# Altium schematic sheet Main_cicuit.SchDoc
size 350 x 469 mm; SheetNumber: 1; SheetTotal: 1; SPICEModelCacheATQZOLGF: <root> / <DocumentId>ATQZOLGF</DocumentId> / <CacheFrame Number="0"> / <Model Name="emk316bbj476_l-t" Kind="CKT"> / <Text>* EMK316BBJ476_L-T     SPICE MODEL  ( General Type ) / *-------------------------------------------------------------------------------------------------------- / * Model Generated by TAIYO YUDEN Corporation (http://www.ty-top.com) / * Version 1.0 / * TAIYO YUDEN Control No. 170508_160201 / * Copyright(c) 2016 TAIYO YUDEN CO.,LTD. All Rights Reserved. / *-------------------------------------------------------------------------------------------------------- / * / * Products Name : Multilayer Ceramic Capacitors / * / * Characteristics : / *     Capacitance : 47 uF , Rated Voltage : 16V , TCC : X5R / *     Case Size : 3.2 x 1.6 / 0.126 x 0.063 [mm/inch] , Thickness : 1.6 / 0.063 [mm/inch] / *     (Conditions: Temperature = 25 degC , DC Bias Current/Voltage = 0A / 0V) / * / * Frequency Range : 40Hz - 3GHz / * / * External Node Assignments : / * / *  1  o---| |---o  2 / * / *-------------------------------------------------------------------------------------------------------- / .SubCkt EMK316BBJ476_L-T 1 2 / **************************** / C0 1 110 39.785u / Cm 1 101 2.9335u / C1 101 102 3.2986u / Rc1 101 102 158.48 / C2 102 103 2.1731u / Rc2 102 103 15.988 / C3 103 110 0.1168u / Rc3 103 110 3.1602 / C2m 1 301 5.1294u / C21 301 302 6.2048u / Rc21 301 302 908.8 / C22 302 303 7.0189u / Rc22 302 303 251.89 / C23 303 304 10.585u / Rc23 303 304 121.1 / C24 304 305 1.745u / Rc24 304 305 66.669 / C25 305 306 2.0483u / Rc25 305 306 43.084 / C26 306 307 0.83506u / Rc26 306 307 3.353 / C27 307 308 0.20912u / Rc27 307 308 8.5674 / C28 308 309 0.87358u / Rc28 308 309 1.8455 / C29 309 110 0.051814u / Rc29 309 110 3.3713 / Rp0 1 110 2.12765957446809Meg / L0 110 120 0.23607n / Lm 120 130 0.28508n / L1 120 121 0.18542n / RL1 121 130 7.9423 / L2 120 122 0.18844n / RL2 122 130 0.11704 / L3 120 123 2.5471n / RL3 123 130 0.25894 / CR 120 124 7.083u / LR 124 125 0.6729n / RR 125 130 10.406m / CL 130 140 0.7161p / LL 130 140 0.23733n / RL 130 140 37.362 / Rs 140 2 2.1493m / **************************** / .ends EMK316BBJ476_L-T</Text> / </Model> / </CacheFrame> / </root>
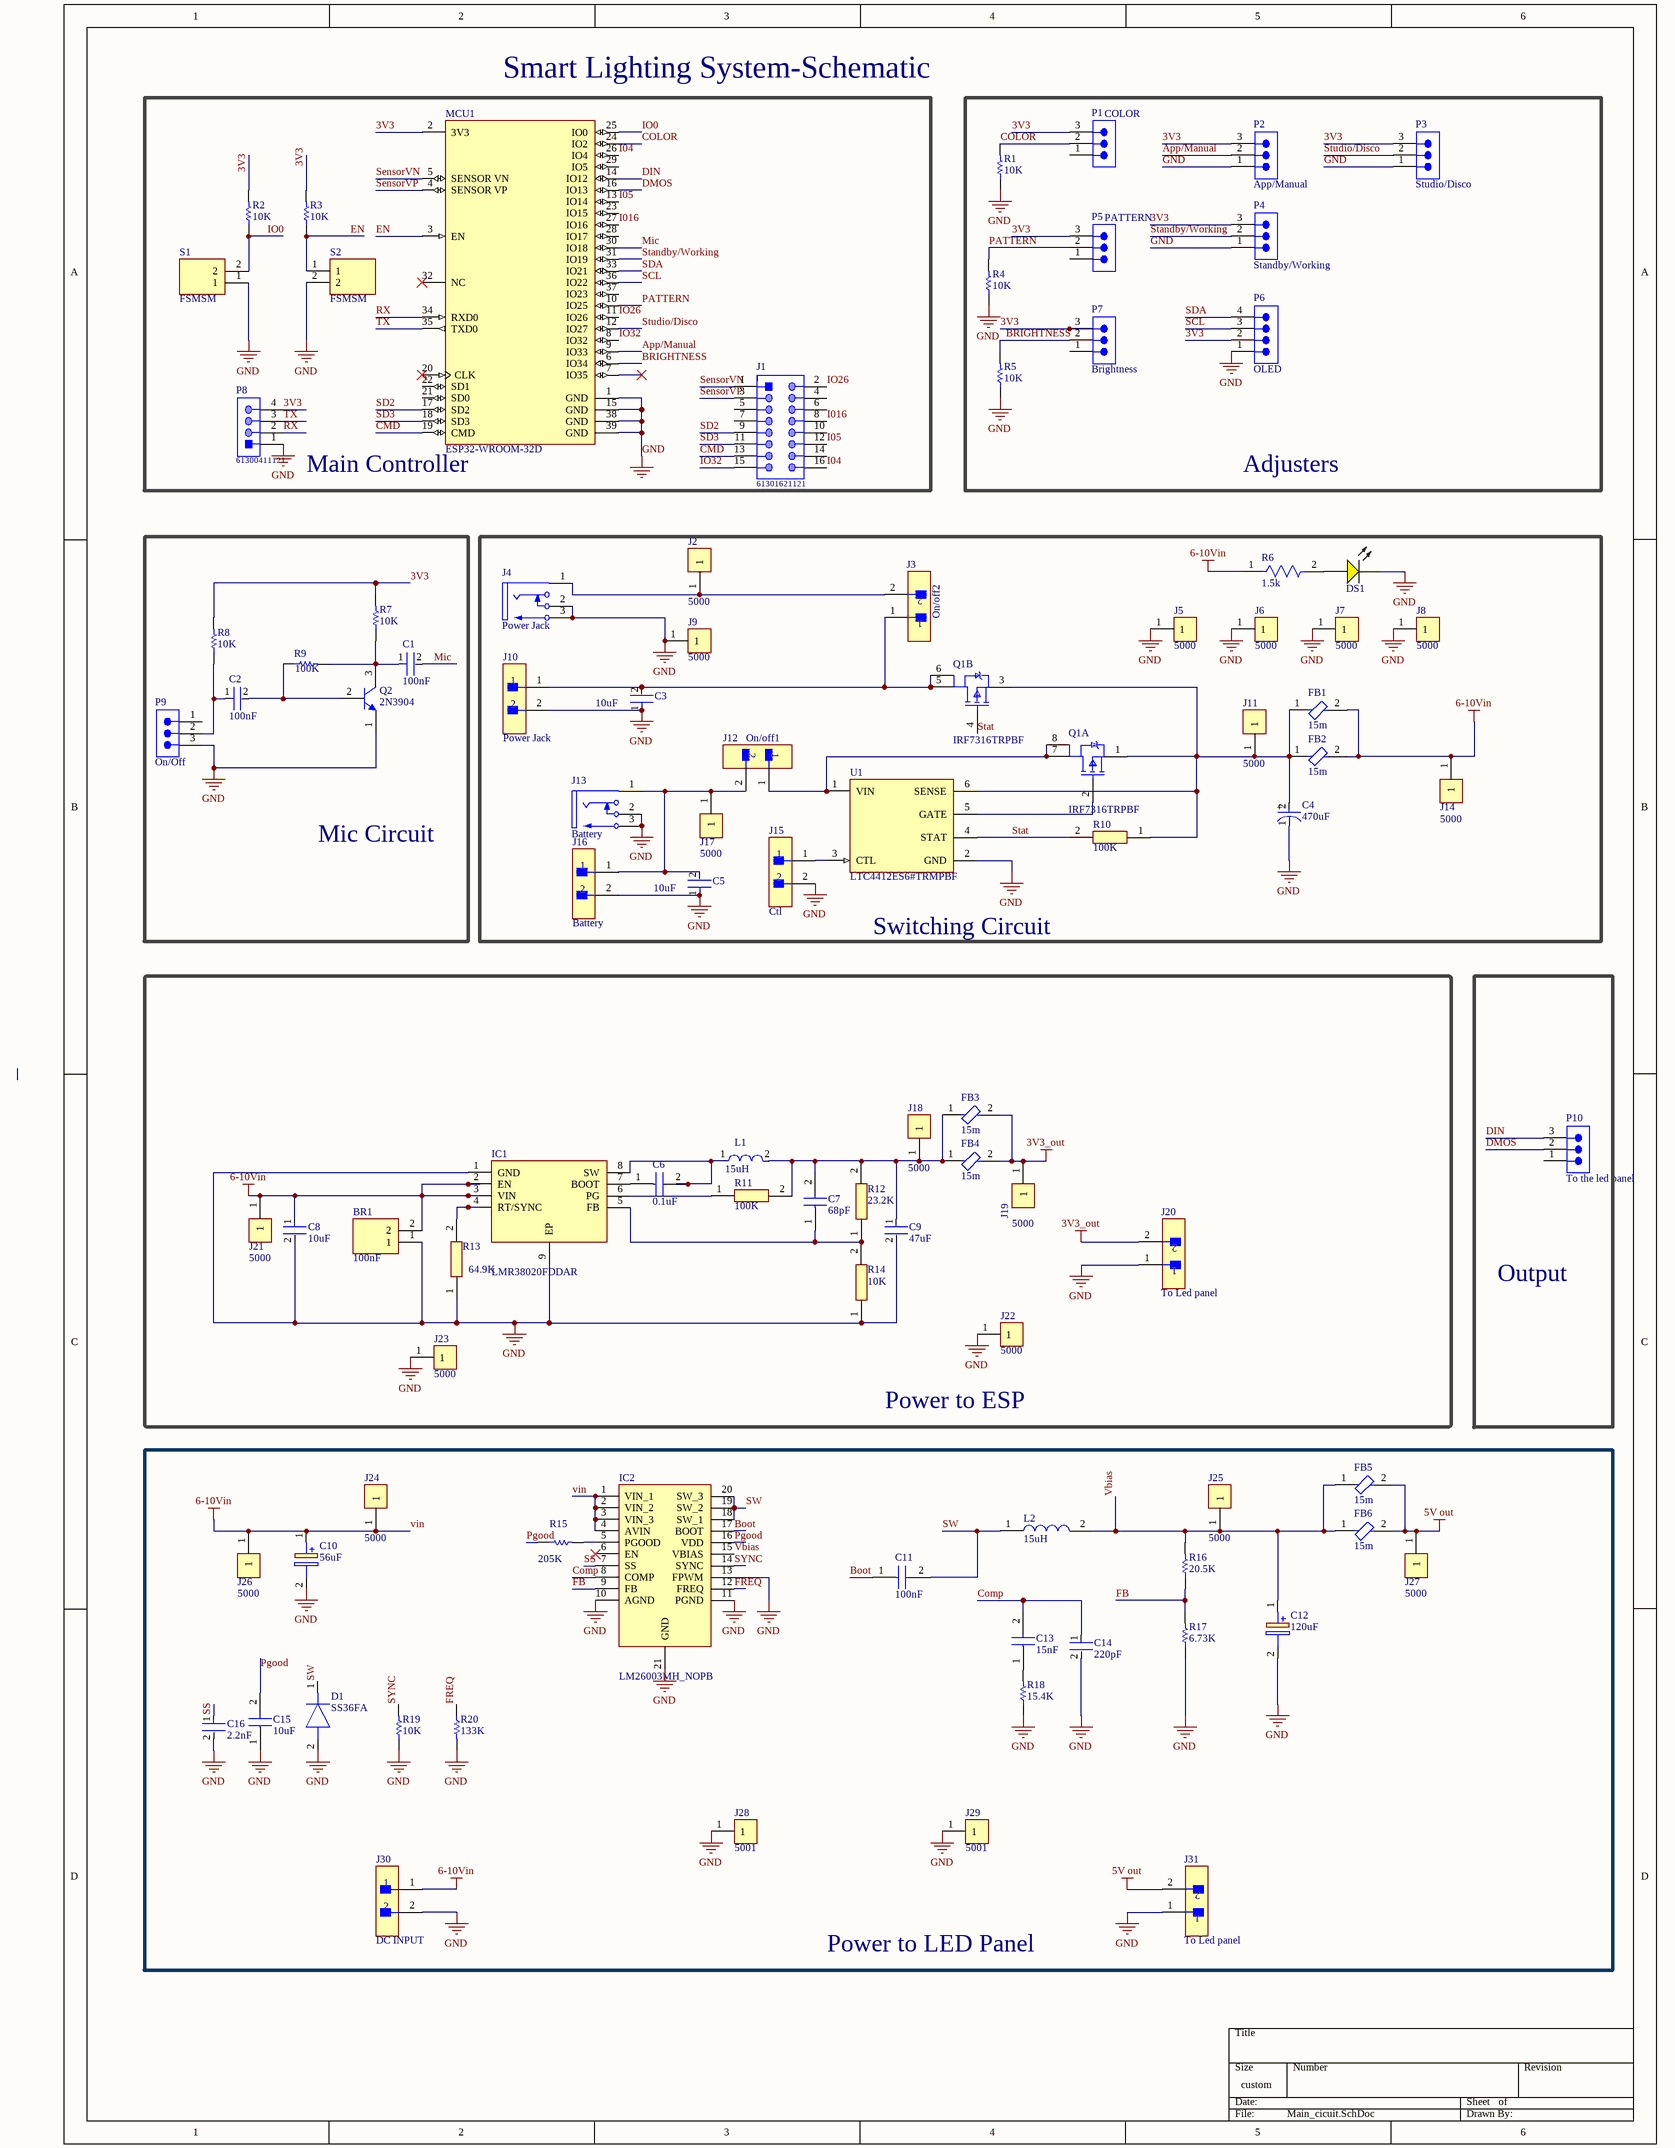
[diagram p0: Main_cicuit.SchDoc]

## Parts
BR1  100nF  [CAPC3216X140N]
C1  100nF  [FP-CL31-IPC_C]
C2  100nF  [FP-CL31-IPC_C]
C3  10uF  [FP-CL21B106KOQNNNG-MFG]
C4  470uF  [FP-FTF-MFG]
C5  10uF  [FP-CL21B106KOQNNNG-MFG]
C6  0.1uF  [CAPC3216X200N]
C7  68pF  [CAPC3216X90N]
C8  10uF  [FP-GRM31C-0_2-e0_3_0_8-MFG]
C9  47uF  [FP-1206-L_3_2_0_3-W_1_6_0-MFG]
C10  56uF  [EEHZA1E101XP]
C11  100nF  [CAPC2013X94N]
C12  120uF  [10SVPC120M]
C13  15nF  [C2012_Commercial]
C14  220pF  [FP-CL21-IPC_B]
C15  10uF  [CAPC3216X170N]
C16  2.2nF  [FP-CL21-IPC_C]
D1  SS36FA  [SODFL3618X143N]
DS1  SML-LX1206YC-TR  [LUMX-SML-LX1206YC-TR_V]  (value not drawn)
FB1  15m  [FP-BLM21-0_2-t0_85-e0_5-d-IPC_B]
FB2  15m  [FP-BLM21-0_2-t0_85-e0_5-d-IPC_B]
FB3  15m  [FP-BLM21-0_2-t0_85-e0_5-d-IPC_B]
FB4  15m  [FP-BLM21-0_2-t0_85-e0_5-d-IPC_B]
FB5  15m  [FP-BLM21-0_2-t0_85-e0_5-d-IPC_B]
FB6  15m  [FP-BLM21-0_2-t0_85-e0_5-d-IPC_B]
IC1  LMR38020FDDAR  [SOIC127P600X170-9N]
IC2  LM26003MH_NOPB  [SOP65P640X110-21N]
J1  61301621121  [61301621121]
J2  5000  [FP-5000-MFG]
J3  On/off2  [FP-61900211121-MFG]
J4  Power Jack  [SWITCH-RAPC712X-3_V]
J5  5000  [FP-5000-MFG]
J6  5000  [FP-5000-MFG]
J7  5000  [FP-5000-MFG]
J8  5000  [FP-5000-MFG]
J9  5000  [FP-5000-MFG]
J10  Power Jack  [FP-61900211121-MFG]
J11  5000  [FP-5000-MFG]
J12  On/off1  [FP-61900211121-MFG]
J13  Battery  [SWITCH-RAPC712X-3_V]
J14  5000  [FP-5000-MFG]
J15  Ctl  [FP-61900211121-MFG]
J16  Battery  [FP-61900211121-MFG]
J17  5000  [FP-5000-MFG]
J18  5000  [FP-5000-MFG]
J19  5000  [FP-5000-MFG]
J20  To Led panel  [FP-61900211121-MFG]
J21  5000  [FP-5000-MFG]
J22  5000  [FP-5000-MFG]
J23  5000  [FP-5000-MFG]
J24  5000  [FP-5000-MFG]
J25  5000  [FP-5000-MFG]
J26  5000  [FP-5000-MFG]
J27  5000  [FP-5000-MFG]
J28  5001  [FP-5001-MFG]
J29  5001  [FP-5001-MFG]
J30  DC INPUT  [FP-61900211121-MFG]
J31  To Led panel  [FP-61900211121-MFG]
L1  15uH  [FP-SRR1260-MFG]
L2  15uH  [INDPM7366X300N]
MCU1  ESP32-WROOM-32D  [FP-ESP32-WROOM-32D-MFG]
P1  COLOR  [SMTC-TSW-103-07-X-S]
P2  App/Manual  [SMTC-TSW-103-07-X-S]
P3  Studio/Disco  [SMTC-TSW-103-07-X-S]
P4  Standby/Working  [SMTC-TSW-103-07-X-S]
P5  PATTERN  [SMTC-TSW-103-07-X-S]
P6  OLED  [SMTC-TSW-104-08-X-S]
P7  Brightness  [SMTC-TSW-103-07-X-S]
P8  61300411121  [61300411121]
P9  On/Off  [SMTC-TSW-103-07-X-S]
P10  To the led panel  [SMTC-TSW-103-07-X-S]
Q1  IRF7316TRPBF  [FP-PG-DSO-8-IPC_B]  (parts A,B of 2)
Q2  2N3904  [ONSC-TO-92-3-29-11]
R1  10K  [RESC3116X65X40ML10T20]
R2  10K  [RESC3116X65X40ML10T20]
R3  10K  [RESC3116X65X40ML10T20]
R4  10K  [RESC3116X65X40ML10T20]
R5  10K  [RESC3116X65X40ML10T20]
R6  1.5k  [FP-CRCW1206-e3-IPC_C]
R7  10K  [RESC3116X65X40ML10T20]
R8  10K  [RESC3116X65X40ML10T20]
R9  100K  [RESC3116X65X40ML10T20]
R10  100K  [RESC3116X65N]
R11  100K  [RESC3116X65N]
R12  23.2K  [ERJ8ENF1000V]
R13  64.9K  [ERJ8ENF1000V]
R14  10K  [ERJ8ENF1000V]
R15  205K  [RESC3216X60X45NL10T20]
R16  20.5K  [RESC2013X70X40NL20T20]
R17  6.73K  [RESC2013X60X35NL10T20]
R18  15.4K  [RESC3216X70X50LL05T20]
R19  10K  [RESC3116X65X40ML10T20]
R20  133K  [RESC3216X70X50LL20T25]
S1  FSMSM  [FSMSM]
S2  FSMSM  [FSMSM]
U1  LTC4412ES6#TRMPBF  [FP-S6-6-05-08-1636-IPC_C]

## Blocks framed on the sheet
Smart Lighting System-Schematic: J1 MCU1 P8 R2 R3 S1 S2
Adjusters: P1-P7 R1 R4 R5
Mic Circuit: C1 C2 P9 Q2 R7-R9
Switching Circuit: C3-C5 DS1 FB1 FB2 J2-J17 Q1 R6 R10 U1
Power to ESP: BR1 C6-C9 FB3 FB4 IC1 J18-J23 L1 R11-R14
Output: P10
Power to LED Panel: C10-C16 D1 FB5 FB6 IC2 J24-J31 L2 R15-R20

## Nets
3V3_out: FB3.2 FB4.2 J19.1 J20.2
5V out: FB5.2 FB6.2 J27.1 J31.2
GND: BR1.1 C3.1 C4.1(C) C5.1 C8.2 C9.2 C10.2(-) C12.2(-) C14.2 C15.1 C16.2 D1.2(A) DS1.2(K) IC1.1(GND) IC1.9(EP) IC2.10(AGND) IC2.11(PGND) IC2.13(FPWM) IC2.21(GND) J4.2 J4.3 J5.1 J6.1 J7.1 J8.1 J9.1 J10.2 J13.2 J13.3 J15.2 J16.2 J20.1 J22.1 J23.1 J28.1 J29.1 J30.2 J31.1 MCU1.1(GND) MCU1.15(GND) MCU1.38(GND) MCU1.39(GND) P2.1 P3.1 P4.1 P6.1 P8.1 P9.3 Q2.1(E) R1.1 R4.1 R5.1 R13.1 R14.1 R17.1 R18.1 R19.1 R20.2 S1.1 S2.2 U1.2(GND)
vin: BR1.2 C8.1 C10.1(+) FB1.2 FB2.2 IC1.2(EN) IC1.3(VIN) IC2.1(VIN_1) IC2.2(VIN_2) IC2.3(VIN_3) IC2.4(AVIN) J14.1 J21.1 J24.1 J26.1 J30.1 R6.1  [also labelled 6-10Vin]
3V3: MCU1.2(3V3) P1.3 P2.3 P3.3 P4.3 P5.3 P6.2 P7.3 P8.4 R2.2 R3.2 R7.2 R8.2
App/Manual: MCU1.9(IO33) P2.2
Boot: C11.1(C1) IC2.17(BOOT)
BRIGHTNESS: MCU1.6(IO34) P7.2 R5.2
CMD: J1.13 MCU1.19(CMD)
COLOR: MCU1.24(IO2) P1.2 R1.2
Comp: C13.2 C14.1 IC2.8(COMP)
DIN: MCU1.14(IO12) P10.3
DMOS: MCU1.16(IO13) P10.2
EN: MCU1.3(EN) R3.1 S2.1
FB: IC2.9(FB) R16.1 R17.2
FREQ: IC2.12(FREQ) R20.1
I04: J1.16 MCU1.26(IO4)
I05: J1.12 MCU1.13(IO14)
I016: J1.8 MCU1.27(IO16)
IO0: MCU1.25(IO0) R2.1 S1.2
IO26: J1.2 MCU1.11(IO26)
IO32: J1.15 MCU1.8(IO32)
Mic: C1.2 MCU1.30(IO18)
PATTERN: MCU1.10(IO25) P5.2 R4.2
Pgood: C15.2 IC2.16(VDD) R15.1
RX: MCU1.34(RXD0) P8.2
SCL: MCU1.36(IO22) P6.3
SD2: J1.9 MCU1.17(SD2)
SD3: J1.11 MCU1.18(SD3)
SDA: MCU1.33(IO21) P6.4
SensorVN: J1.1 MCU1.5(SENSOR_VN)
SensorVP: J1.3 MCU1.4(SENSOR_VP)
SS: C16.1 IC2.7(SS)
Standby/Working: MCU1.31(IO19) P4.2
Stat: Q1.4(G2) R10.2 U1.4(STAT)
Studio/Disco: MCU1.12(IO27) P3.2
SW: C11.2(C2) D1.1(K) IC2.18(SW_1) IC2.19(SW_2) IC2.20(SW_3) L2.1
SYNC: IC2.14(SYNC) R19.2
TX: MCU1.35(TXD0) P8.3
Vbias: C12.1(+) FB5.1 FB6.1 IC2.15(VBIAS) J25.1 L2.2 R16.2
NetC1_1: C1.1 Q2.3(C) R7.1 R9.2
NetC2_1: C2.1 P9.2 R8.1
NetC2_2: C2.2 Q2.2(B) R9.1
NetC3_2: C3.2 J3.1 J10.1 Q1.5(D2) Q1.6(D2)
NetC4_2: C4.2(A) FB1.1 FB2.1 J11.1 Q1.1(S1) Q1.3(S2) R10.1 U1.6(SENSE)
NetC5_2: C5.2 J12.2 J13.1 J16.1 J17.1
NetC6_1: C6.1 IC1.7(BOOT)
NetC6_2: C6.2 IC1.8(SW) L1.1
NetC7_1: C7.1 IC1.5(FB) R12.1 R14.2
NetC7_2: C7.2 C9.1 FB3.1 FB4.1 J18.1 L1.2 R11.2 R12.2
NetC13_1: C13.1 R18.2
NetDS1_1: DS1.1(A) R6.2
NetIC1_4: IC1.4(RT/SYNC) R13.2
NetIC1_6: IC1.6(PG) R11.1
NetIC2_5: IC2.5(PGOOD) R15.2
NetJ2_1: J2.1 J3.2 J4.1
NetJ12_1: J12.1 Q1.7(D1) Q1.8(D1) U1.1(VIN)
NetJ15_1: J15.1 U1.3(CTL)
NetQ1_2: Q1.2(G1) U1.5(GATE)

Not connected (* = marked no-connect by the designer): IC2 6(EN)*; J1 4 5 6 7 10 14; MCU1 7(IO35)* 20(CLK)* 21(SD0) 22(SD1) 23(IO15) 28(IO17) 29(IO5) 32(NC)* 37(IO23); P1 1; P5 1; P7 1; P9 1; P10 1

## Notes on the sheet
- (near MCU1) Main Controller
- (in symbol CMP-05427-000040-1) +

## Library data of the parts
BR1 = C1206C104M4RECTU: Bridge Rectifier; Manufacturer_Name: KEMET; Datasheet Link: https://content.kemet.com/datasheets/KEM_C1090_X7R_ESD.pdf; Height: 1.4mm; Manufacturer_Part_Number: C1206C104M4RECTU; Mouser Part Number: 80-C1206C104M4RECTU; Mouser Price/Stock: https://www.mouser.co.uk/ProductDetail/KEMET/C1206C104M4RECTU?qs=55YtniHzbhBHBRCpbCB%2Feg%3D%3D
C1 C2 = CMP-13271-001514-1: Cap Ceramic 100nF 100V X7R ±10% SMD 1206 +125°C Embossed T/R; Mount: Surface Mount; Material: Ceramic; Radiation Hardening: No; Depth: 1.6mm; Min Operating Temperature: -55°C; Contact Plating: Tin; Case Code (Imperial): 1206; Voltage: 100V; Width: 0.063inch; Capacitance: 100nF; Voltage Rating: 100V; Packaging: Tape and Reel; Voltage Rating (DC): 100V; Length: 3.2mm; Thickness: 0.055inch; Height: 1.25mm; Package Quantity: 1; Dielectric: X7R; Max Operating Temperature: 125°C; Case Code (Metric): 3216; Lead Free: Lead Free; Case/Package: 1206; Tolerance: 10%
C3 C5 = CMP-13271-000015-1: CAP CER 10UF 16V X7R 0805; Manufacturer Part Number: CL21B106KOQNNNG; Manufacturer: Samsung Electro-Mechanics; Temperature Coefficient: 15%; Tolerance: 10%; Material: Ceramic; ComponentLink2URL: http://product.samsungsem.com/mlcc/CL21B106KOQNNN.do; Package: 0; Voltage Rating: 16V; Value: 10uF; Height: 1.4mm; Temperature Characteristic: X7R; Category: Cap; Lead Free: Yes; RoHS: TRUE; ComponentLink2Description: Datasheet; Octopart: https://octopart.com/cl21b106koqnnng-samsung-19995691; Device Class L1: Passive Components; Temperature Range Low: -55°C; Device Class L3: Ceramic Capacitors; Ipc Land Pattern Name: CAPC200125X125; Digikey Description: CAP CER 10UF 16V X7R 0805; Automotive: No; Capacitance: 10uF; Temperature Range High: +125°C; Device Class L2: Capacitors; Temperature: -55°C to +125°C
C4 = CMP-05427-000040-1: CAP ALUM 470UF 20% 25V SMD; ESR (Equivalent Series Resistance): 80mR; Dielectric Material: Aluminium; Lead Diameter: 0.9mm; Ripple Current: 850mA; Leakage Current: 117.5uA; Life (Hours): 2000Hour; Lead Free: Lead Free; Height - Seated (Max): 0.413inch; Contact Plating: Tin; Voltage: 25V; Package Quantity: 500; REACH SVHC: No SVHC; Diameter: 8mm; Features: General Purpose; Voltage Rating: 25V; Radiation Hardening: No; Number of Pins: 2; Length: 10.2mm; Max Operating Temperature: 105°C; Tolerance: 20%; Lead Pitch: 3.1mm; Voltage Rating (DC): 25V; Packaging: Tape and Reel; RoHS Compliant: Yes; Series: FT; Height: 10.2mm; Capacitance: 470uF; Construction: Cylindrical; Case/Package: Radial; Mount: Surface Mount; Termination: SMD/SMT; Min Operating Temperature: -55°C; Ripple Current (AC): 850mA
C6 = GCJ31CR72E104KXJ3L: Capacitor; Manufacturer_Name: Murata Electronics; Datasheet Link: https://psearch.en.murata.com/capacitor/product/GCJ31CR72E104KXJ3%23.html; Height: 2mm; Manufacturer_Part_Number: GCJ31CR72E104KXJ3L; Mouser Part Number: 81-GCJ31CR72E104KX3L; Mouser Price/Stock: https://www.mouser.com/Search/Refine.aspx?Keyword=81-GCJ31CR72E104KX3L; Arrow Part Number: GCJ31CR72E104KXJ3L; Arrow Price/Stock: https://www.arrow.com/en/products/gcj31cr72e104kxj3l/murata-manufacturing
C7 = 885012008022: Capacitor; Manufacturer_Name: Wurth Elektronik; Datasheet Link: https://katalog.we-online.com/pbs/datasheet/885012008022.pdf; Height: 0.9mm; Manufacturer_Part_Number: 885012008022
C8 = CMP-06035-003589-1: Chip Multilayer Ceramic Capacitors for General Purpose, 1206, 10uF, X7R, 15%, 10%, 25V; Case Code (Imperial): 1206; Voltage Rating (DC): 25V; Voltage Rating: 25V; Length: 3.2mm; Lead Free: Lead Free; Thickness: 0.071inch; Package Quantity: 1; Width: 1.6mm; Max Operating Temperature: 125°C; Number of Pins: 2; Height: 1.6mm; Case Code (Metric): 3216; REACH SVHC: No SVHC; Radiation Hardening: No; Case/Package: 1206; Material: Ceramic; Tolerance: 10%; Voltage: 25V; Mount: Surface Mount; Packaging: Tape and Reel; Dielectric: X7R; Termination: SMD/SMT; Min Operating Temperature: -55°C; Capacitance: 10uF; Depth: 1.6mm
C9 = CMP-14477-000191-2: None; Voltage Rating: 16V; Tolerance: 20%; Capacitance: 47uF; RoHS Compliant: Yes; Case Code (Imperial): 1206; Packaging: Tape and Reel; Mount: Surface Mount; Case Code (Metric): 3216; Case/Package: 1206; Max Operating Temperature: 85°C; Min Operating Temperature: -55°C
C10 = EEH-ZC1E560P: Capacitor Polarised; Manufacturer_Name: Panasonic; Datasheet Link: http://industrial.panasonic.com/cdbs/www-data/pdf/RDD0000/ABA0000C1234.pdf; Height: 8.3mm; Manufacturer_Part_Number: EEH-ZC1E560P; Mouser Part Number: 667-EEH-ZC1E560P; Mouser Price/Stock: https://www.mouser.co.uk/ProductDetail/Panasonic/EEH-ZC1E560P?qs=7UCyOFMWVHYdN59awcl%252BRg%3D%3D; Arrow Part Number: EEH-ZC1E560P; Arrow Price/Stock: https://www.arrow.com/en/products/eeh-zc1e560p/panasonic
C11 = 08053C104JAZ2A: Capacitor; Manufacturer_Name: AVX; Manufacturer_Part_Number: 08053C104JAZ2A; Mouser Part Number: 581-08053C104JAZ2A; Mouser Price/Stock: https://www.mouser.co.uk/ProductDetail/AVX/08053C104JAZ2A?qs=YtXa1zY%252Bjw7108MDhSwtdw%3D%3D; Arrow Part Number: 08053C104JAZ2A; Arrow Price/Stock: https://www.arrow.com/en/products/08053c104jaz2a/avx
C12 = 10SVPC120M: Capacitor Polarised; Manufacturer_Name: Panasonic; Datasheet Link: http://industrial.panasonic.com/cdbs/www-data/pdf/AAB8000/AAB8000C256.pdf; Height: 6mm; Manufacturer_Part_Number: 10SVPC120M; Mouser Part Number: 667-10SVPC120M; Mouser Price/Stock: https://www.mouser.com/Search/Refine.aspx?Keyword=667-10SVPC120M; Arrow Part Number: 10SVPC120M; Arrow Price/Stock: https://www.arrow.com/en/products/10svpc120m/panasonic
C13 = C2012C0G1H153J085AA: Capacitor; Manufacturer_Name: TDK; Datasheet Link: https://product.tdk.com/system/files/dam/doc/product/capacitor/ceramic/mlcc/catalog/mlcc_commercial_general_en.pdf; Height: 0.75mm; Manufacturer_Part_Number: C2012C0G1H153J085AA; Mouser Part Number: 810-C2012C0G1H153J; Mouser Price/Stock: https://www.mouser.co.uk/ProductDetail/TDK/C2012C0G1H153J085AA?qs=dfay7wIA1uEj7b9yh3tmgQ%3D%3D; Arrow Part Number: C2012C0G1H153J085AA; Arrow Price/Stock: https://www.arrow.com/en/products/c2012c0g1h153j085aa/tdk
C14 = CMP-13271-001616-1: CL21 Series 0805 220pF 50V ±5% Tolerance C0G Multilayer Ceramic Chip Capacitor; Temperature Coefficient: 300ppm/°C; Tolerance: 5%; Voltage Rating (DC): 50V; Case/Package: 0805; Dielectric: C0G; Voltage Rating: 50V; Width: 0.049inch; Package Quantity: 1; Min Operating Temperature: -55°C; Depth: 1.25mm; Max Operating Temperature: 125°C; Case Code (Metric): 2012; Capacitance: 220pF; Mount: Surface Mount; Length: 2mm; Packaging: Tape and Reel; Lead Free: Lead Free; Height: 0.65mm; Voltage: 50V; Thickness: 0.03inch; Material: Ceramic; Case Code (Imperial): 0805; Radiation Hardening: No
C15 = VJ1206G106KXYTW1BC: Capacitor; Manufacturer_Name: Vishay; Datasheet Link: http://www.vishay.com/docs/45200/vjhirelseries.pdf; Height: 1.7mm; Manufacturer_Part_Number: VJ1206G106KXYTW1BC; Mouser Part Number: 77-VJ1206G106KXYTBC; Mouser Price/Stock: https://www.mouser.co.uk/ProductDetail/Vishay-Vitramon/VJ1206G106KXYTW1BC?qs=M2lRuB1aacFuy6AOB5Fp%252Bg%3D%3D; Arrow Part Number: VJ1206G106KXYTW1BC; Arrow Price/Stock: https://www.arrow.com/en/products/vj1206g106kxytw1bc/vishay?region=nac
C16 = CMP-13271-001564-1: CL21 Series 0805 2.2nF 50V ±5% Tolerance C0G Multilayer Ceramic Chip Capacitor; Mount: Surface Mount; Packaging: Tape and Reel; Tolerance: 5%; Thickness: 0.053inch; Case Code (Imperial): 0805; Capacitance: 2.2nF; Min Operating Temperature: -55°C; Width: 0.049inch; Package Quantity: 2000; Depth: 1.25mm; Radiation Hardening: No; Voltage Rating (DC): 50V; Case/Package: 0805; Voltage: 50V; Max Operating Temperature: 125°C; Case Code (Metric): 2012; Voltage Rating: 50V; Length: 2mm; Dielectric: C0G; Height: 1.25mm; Lead Free: Lead Free
D1 = SS36FA: Diode; Manufacturer_Name: onsemi; Datasheet Link: http://www.mouser.com/ds/2/149/SS36FA-1012713.pdf; Height: 1.43mm; Manufacturer_Part_Number: SS36FA; Mouser Part Number: 512-SS36FA; Mouser Price/Stock: https://www.mouser.co.uk/ProductDetail/onsemi-Fairchild/SS36FA?qs=R26iFe%2FkX%2FItXtD88dS%252Bdg%3D%3D; Arrow Part Number: SS36FA; Arrow Price/Stock: https://www.arrow.com/en/products/ss36fa/on-semiconductor?region=nac
DS1 = CMP-2000-07124-1: Yellow LED, Water Clear Len, 585 nm, 2.1 V, -40 to 85 degC, 2-Pin SMD, RoHS, Tape and Reel; Manufacturer: Lumex; Product Training Modules: LEDsBenefitsofCustomLEDandLCDTechnology; Millicandela Rating: 6mcd; Catalog Drawings: SML-LX1206SeriesTopSML-LX1206SeriesSideSML-LX1206SeriesBottomSML-LX1206SeriesFootprint; Wavelength - Peak: 585nm; Other Names: 67-1358-2LU60357TRSMLLX1206YCTR; Lens Style/Size: RectanglewithFlatTop; Current - Test: 20mA; Lens Color: Colorless; Viewing Angle: 160°; Voltage - Forward (Vf) (Typ): 2.1V; Online Catalog: SML-LX1206RectanglewithFlatTop1206PackageLEDs; Mounting Type: SurfaceMount; Package Description: 2-Pin Surface Mount Device, Body 3.2 x 1.5 mm; Datasheet Version: Rev. K, 08/2012; Features: -; Color: Yellow; RoHS Information: RoHSCertofCompliance; Package Reference: SML-LX1206YC-TR; Supplier Device Package: 1206; Standard Package: 3,000; Series: -; Wavelength - Dominant: -; Package / Case: 1206(3216Metric); Mounting Technology: SurfaceMount; Height (Max): 1.10mm; Lens Transparency: Clear; Datasheet URL: http://www.lumex.com/content/files/ProductAttachment/SML-LX1206YC-TR.pdf; Family: LEDIndication-Discrete; Manufacturer URL: http://www.lumexinstruments.com/; Packaging: Tape&Reel(TR); Category: Optoelectronics; Size / Dimension: 3.20mmLx1.60mmW
FB1-FB6 = CMP-06046-001820-1: Chip Ferrite Bead, 0805, 30Ω @ 100MHz, 0.014Ω, , 4A; Impedance: 30R; Shielding: Unshielded; Max DC Current: 3A; Tolerance: 25%; DC Resistance (DCR): 14mR; Material: Steel; Number of Lines: 1; DC Resistance-Max: 15MR; Core Material: Ferrite; Mount: Surface Mount; Packaging: Tape and Reel; Depth: 1.45mm; Height: 0.041inch; Weight: 0.000194oz; Case Code (Metric): 2012; Ratings: AEC-Q200; Test Frequency: 100MHz; Series: EMIFIL®, BLM21P; Max Operating Temperature: 125°C; Case/Package: 0805; Lead Free: Lead Free; Length: 2mm; REACH SVHC: No SVHC; Case Code (Imperial): 0805; Width: 1.25mm; Package Quantity: 4000; Termination: SMD/SMT; Max Current Rating: 4A; Min Operating Temperature: -55°C; RoHS Compliant: Yes; Current Rating: 3A; Number of Circuits: 1
IC1 = LMR38020FDDAR: Integrated Circuit; Manufacturer_Name: Texas Instruments; Datasheet Link: https://www.ti.com/product/LMR38020; Height: 1.7mm; Manufacturer_Part_Number: LMR38020FDDAR; Mouser Part Number: 595-LMR38020FDDAR; Mouser Price/Stock: https://www.mouser.co.uk/ProductDetail/Texas-Instruments/LMR38020FDDAR?qs=Li%252BoUPsLEnv2har3ftPY1A%3D%3D; Arrow Part Number: LMR38020FDDAR; Arrow Price/Stock: https://www.arrow.com/en/products/lmr38020fddar/texas-instruments?region=nac
IC2 = LM26003MH_NOPB: Integrated Circuit; Manufacturer_Name: Texas Instruments; Manufacturer_Part_Number: LM26003MH/NOPB; Datasheet Link: http://www.ti.com/lit/gpn/lm26003; Height: 1.1mm; Mouser Part Number: 926-LM26003MH/NOPB; Mouser Price/Stock: https://www.mouser.co.uk/ProductDetail/Texas-Instruments/LM26003MH-NOPB?qs=X1J7HmVL2ZGyWWBRLQRegQ%3D%3D
J1 = CMP-1502-01097-1: THT Vertical Pin Header WR-PHD, Pitch 2.54 mm, Dual Row, 16 pins; Manufacturer: Wurth Elektronik; Gender: Male; Rated Current: 3A; Pitch: 2.54mm; Withstanding Voltage: 500VAC; Contact Resistance: 20mOhm; Working Voltage: 250VAC; Pin Number: 16; Mounting Technology: THT; Orientation: Vertical; Manufacturer URL: http://www.we-online.de; Row Number: Dual; Part Number: 61301621121; Datasheet URL: https://katalog.we-online.de/em/datasheet/6130xx21121.pdf; Packaging: Bag; Operating Temperature: -40to105degC; Publisher: WurthElektronik; Package Reference: 61301621121
J2 J5-J9 J11 J14 J17-J19 J21-J27 = CMP-19636-000027-1: PC TEST POINT MINIATURE RED; Outside Diameter: 2.54mm; Body Material: Bronze; Number of Contacts: 1; Insulation: Insulated; Inside Diameter: 1.27mm; Hole Diameter: 1.6mm; Plating: Silver; Length: 7.62mm; Package Quantity: 100; Number of Ports: 1; Contact Material: Bronze; Orientation: Straight; RoHS Compliant: Yes; Housing Color: Red; Height: 0.3inch; Series: THM; Lead Free: Lead Free; Color: Red; Contact Plating: Tin; Mount: PCB; Packaging: Bulk; REACH SVHC: No SVHC; Flammability Rating: UL94 V-0; Material: Nylon
J3 J10 J12 J15 J16 J20 J30 J31 = CMP-1502-00584-2: CONN HEADER VERT 2POS 2.54MM; Number of Contacts: 2; Gender: Male; Current Rating: 3A; Voltage Rating: 250V; Insulation Resistance: 1GR; Contact Material: Copper Alloy; Package Quantity: 1000; Color: Beige; Mount: Through Hole; Termination: Through Hole; Fastening Type: Friction; Contact Mating Length: 0.295inch; Pitch: 2.54mm; Max Operating Temperature: 105°C; Height: 14.2mm; RoHS Compliant: Yes; Packaging: Bulk; Contact Type: Male Pin; Width: 5.12mm; Housing Material: Nylon; Min Operating Temperature: -40°C; Insulation Material: Nylon; Contact Finish - Mating: TIN; Insulation Color: Beige; Contact Plating: Tin; Flammability Rating: UL94 V-0; Length: 5.8mm; Contact Gender: Male; Connector Type: Header; Contact Shape: Square; Series: WR-WTB; Number of Positions: 2; Number of Rows: 1
J4 J13 = CMP-2000-05384-1: Power Jack, 5 A, 3-Pin THD, RoHS, Bulk; Manufacturer: Switchcraft; Current Rating: 5A; Plug/Mating Plug Diameter: 2.1mmID,5.5mmOD; Gender: Male; Mating Products: S765-ND / -CONNPLUGMINIPWR2CONDWHT/RED / S760K-ND / -CONNPOWERPLUGMINI.08"BLACK / SC1052-ND / -CONNPOWERPLUGMINIBLACK; Number of Positions/Contacts: 2Conductors,2Contacts; Internal Switch(s): SingleSwitch,NormallyClosed; Shielding: Unshielded; Catalog Drawings: RAPC7(1,2)2XSide / RAPC7(1,2)2XTop; Dynamic Catalog: SwitchcraftInc; Other Names: Q2287470A / RAPC722X-ND / SC1313; Standard Package: 2,500; Termination: SolderEyelet(s); Family: Barrel-PowerConnectors; Housing Color: Black; Housing Material: Thermoplastic; RoHS Information: SwitchcraftRoHSInfo; Color: Black; Contact Material - Plating: Nickel; Mounting Type: ThroughHole,RightAngle; Manufacturer URL: http://www.switchcraft.com/; Contact Material: Brass; Datasheet Version: Rev. A, 08/2005; Connector Type: Jack; Category: Connectors,Interconnects; Datasheet URL: http://www.mouser.com/ds/2/393/rapc722x_cd-371352.pdf
J28 J29 = CMP-2000-05181-2: PC TEST POINT MINIATURE BLACK; Body Material: Bronze; Plating: Silver; Inside Diameter: 1.27mm; Hole Diameter: 1.6mm; Number of Ports: 1; Outside Diameter: 2.54mm; Insulation: Insulated; Insulation Material: Nylon; Mount: Through Hole; RoHS Compliant: Yes; Series: THM; Height: 0.3inch; Termination: Through Hole; Material: Nylon; Packaging: Bulk; Contact Material: Bronze; REACH SVHC: No SVHC; Contact Plating: Silver; Orientation: Straight; Lead Free: Lead Free; Package Quantity: 100; Length: 7.62mm; Flammability Rating: UL94 V-0; Number of Contacts: 1; Diameter: 2.54mm; Housing Color: Black; Color: Black
L1 = CMP-2000-07146-2: FIXED IND 15UH 5A 27 MOHM SMD; Q Factor: 25; Sample Rate (Hz): 100kHz; Resistance: 27MR; Material: Steel; Inductance Tolerance: 20%; Frequency: 17.6MHz; Saturation Current: 4.6A; Core Material: Ferrite; Shielding: Shielded; Series: SRR1260; Termination: SMD/SMT; Packaging: Tape and Reel; RoHS Compliant: Yes; Height - Seated (Max): 0.256inch; Depth: 12.8mm; Case/Package: 1260; Inductance: 15uH; Height: 6mm; Number of Pins: 2; Mount: Surface Mount; Min Operating Temperature: -40°C; Test Frequency: 100kHz; Length: 12.5mm; Self Resonant Frequency: 17.6MHz; Current Rating: 5A; Tolerance: 20%; RMS Current (Irms): 5A; REACH SVHC: No SVHC; Resistor Type: Wirewound; DC Resistance (DCR): 27mR; Width: 12.5mm; Package Quantity: 600; DC Current: 5A; Max DC Current: 5A; Max Operating Temperature: 125°C; Military Standard: Not
L2 = SRP7028A-150M: Inductor; Manufacturer_Name: Bourns; Datasheet Link: https://www.arrow.com/en/products/srp7028a-150m/bourns; Height: 3mm; Manufacturer_Part_Number: SRP7028A-150M; Mouser Part Number: 652-SRP7028A-150M; Mouser Price/Stock: https://www.mouser.co.uk/ProductDetail/Bourns/SRP7028A-150M?qs=6oMev5NRZMFBVnjP7eUaag%3D%3D; Arrow Part Number: SRP7028A-150M; Arrow Price/Stock: https://www.arrow.com/en/products/srp7028a-150m/bourns
MCU1 = CMP-194065-000003-1: WIFI MODULE 32MBITS SPI FLASH; Manufacturer: Espressif Systems; Max Supply Voltage: 3.6V; Nominal Supply Current: 500mA; Max Frequency: 2484MHz; Number Of Adc Channels: 16; Number Of Gpio: 32; Interface: I2C,SPI,UART,Ethernet,I2S,Other; Data Rate: 150Mbits/s; Min Supply Voltage: 3V; Bandwidth: 72MHz; Sensitivity: -98dBm; Octopart: https://octopart.com/esp32-wroom-32d-espressif+systems-91040050; Package: ESP32-WROOM-32D; ComponentLink2URL: https://www.espressif.com/sites/default/files/documentation/esp32-wroom-32d_esp32-wroom-32u_datasheet_en.pdf; Lead Free: Yes; Category: UNK; Mouser Description: Wi-Fi/BT BLE Module ESP32-D0WD, SPI Flash, UART, P; Device Class L1: Integrated Circuits (ICs); RoHS: TRUE; Temperature Range Low: -40°C; ComponentLink2Description: Datasheet; Digikey Description: WIFI MODULE 32MBITS SPI FLASH; Height: 3.2mm; Temperature: -40°C to +85°C; Manufacturer Part Number: ESP32-WROOM-32D; Device Class L3: Transceivers; Device Class L2: RF Semiconductors and Devices; Temperature Range High: +85°C; Automotive: No
P1-P5 P7 P9 P10 = CMP-1024-00331-1: 0.025" SQ Post Header, Through-hole, Vertical, -55 to 125 degC, 2.54 mm Pitch, 3-Pin, Male, RoHS; Manufacturer: Samtec; PartNumber: TSW-103-07-F-S; Pitch: 2.54 mm; DatasheetVersion: F-214; ComponentLink1Description: Manufacturer URL; ComponentLink3URL: http://www.samtec.com/documents/webfiles/cpdf/TSW-XXX-XX-XXX-X-XX-XXX-MKT.pdf; Mounting Technology: Through-hole; PackageDescription: .025[0.64] SQ. Post Terminal Strip Assembly; Temperature Range: -55 to 125 degC; ComponentLink3Description: Package Specification; Orientation: Vertical; RoHS: True; PackageVersion: DM, 8/1988; ComponentLink2Description: Datasheet; ComponentLink1URL: http://www.samtec.com; ComponentLink2URL: http://www.samtec.com/documents/webfiles/pdf/TSW_TH.PDF; PackageReference: TSW-103-07-X-S
P6 = CMP-1024-00357-1: 0.025" SQ Post Header, Through-hole, Vertical, -55 to 125 degC, 2.54 mm Pitch, 4-Pin, Male, RoHS; Manufacturer: Samtec; PartNumber: TSW-104-08-G-S; Pitch: 2.54 mm; RoHS: True; ComponentLink3URL: http://www.samtec.com/documents/webfiles/cpdf/TSW-XXX-XX-XXX-X-XX-XXX-MKT.pdf; Mounting Technology: Through-hole; ComponentLink2URL: http://www.samtec.com/documents/webfiles/pdf/TSW_TH.PDF; ComponentLink1URL: http://www.samtec.com; ComponentLink3Description: Package Specification; PackageVersion: DM, 8/1988; ComponentLink2Description: Datasheet; PackageReference: TSW-104-08-X-S; PackageDescription: .025[0.64] SQ. Post Terminal Strip Assembly; ComponentLink1Description: Manufacturer URL; Temperature Range: -55 to 125 degC; DatasheetVersion: F-214; Orientation: Vertical
P8 = CMP-1502-01064-1: THT Vertical Pin Header WR-PHD, Pitch 2.54 mm, Single Row, 4 pins; Manufacturer: Wurth Elektronik; Withstanding Voltage: 500VAC; Rated Current: 3A; Working Voltage: 250VAC; Pin Number: 4; Gender: Male; Contact Resistance: 20mOhm; Pitch: 2.54mm; Manufacturer URL: http://www.we-online.de; Operating Temperature: -40to105degC; Packaging: Bag; Mounting Technology: THT; Package Reference: 61300411121; Datasheet URL: https://katalog.we-online.de/em/datasheet/6130xx11121.pdf; Publisher: WurthElektronik; Part Number: 61300411121; Row Number: Single; Orientation: Vertical
Q1 = CMP-32901-000528-1: MOSFET 2P-CH 30V 4.9A 8-SOIC; Drain to Source Breakdown Voltage: -30V; Gate to Source Voltage (Vgs): 20V; Rise Time: 13ns; Turn-Off Delay Time: 34ns; Max Power Dissipation: 2W; Drain to Source Resistance: 98mR; Threshold Voltage: -1V; Input Capacitance: 710pF; Rds On Max: 58mR; Min Operating Temperature: -55°C; REACH SVHC: No SVHC; Drain to Source Voltage (Vdss): -30V; Max Dual Supply Voltage: -30V; Case/Package: SO; Lead Free: Lead Free; Contact Plating: Tin; Number of Pins: 8; RoHS Compliant: Yes; Turn-On Delay Time: 13ns; Max Operating Temperature: 150°C; Packaging: Tape and Reel; Power Dissipation: 2W; Mount: Surface Mount; Height: 0.059inch; Halogen Free: Halogen Free; Width: 0.157inch; Continuous Drain Current (ID): 4.9A; Length: 0.196inch
Q2 = CMP-2000-05562-1: General Purpose Transistor, NPN Silicon, 200 mA, 60 V, -55 to 150 degC, 3-Pin TO-92, RoHS, Bulk; Manufacturer: ONSemiconductor; Emitter- Base Voltage VEBO: 6V; Maximum Power Dissipation: 625mW; Maximum DC Collector Current: 0.2A; Collector- Emitter Voltage VCEO Max: 40V; Collector- Base Voltage VCBO: 60V; DC Collector/Base Gain hfe Min: 60; Configuration: Single; Collector-Emitter Saturation Voltage: 0.3V; Gain Bandwidth Product fT: 270MHz; Mounting Style: ThroughHole; Package / Case: TO-92-3(TO-226); Mounting Technology: ThroughHole; Minimum Operating Temperature: -65C; Datasheet Version: Rev. 8, 08/2012; Product Category: BipolarTransistors-BJT; Factory Pack Quantity: 5000; Transistor Polarity: NPN; Package Description: 3-Pin Transistor Outline, Body 4.825 x 3.685 mm, Pitch 1.27 mm; RoHS: Details; Datasheet URL: https://datasheet.ciiva.com/4725/2n3903-d-285841-4725808.pdf; Packaging: Bulk; Maximum Operating Temperature: +150C; Package Reference: TO-92-3-29-11; Brand: ONSemiconductor; Manufacturer URL: http://www.onsemi.com/
R1-R5 R7 R8 R19 = CMP-1014-00623-2: Chip Resistor, 10 KOhm, +/- 1%, 0.25 W, -55 to 155 degC, 1206 (3216 Metric), RoHS, Tape and Reel; Manufacturer: Yageo; Voltage Rating: 200V; Resistance: 10KOhm; Temperature Coefficient: 100ppm/degreesC; Power Rating: 250mW; Packaging: TapeandReel; Termination: SMD/SMT; REACH SVHC: Unknown; Tolerance: 1%; Height: 0.55mm; Composition: ThickFilm; Max Operating Temperature: 155degC; Datasheet Version: Rev. 5, 10/2016; Lead Free: LeadFree; Case Code (Metric): 3216; Depth: 1.6mm; Package Quantity: 5000; RoHSCompliant: true; Military Standard: Not; Case/Package: 1206; Case Code (Imperial): 1206; Min Operating Temperature: -55degC; Datasheet URL: http://www.yageo.com/NewPortal/yageodocoutput?fileName=/pdf/R-Chip/PYu-RC_Group_51_RoHS_L_5.pdf; Length: 3.1mm; Manufacturer URL: http://www.yageo.com/; Package Reference: 1206.0; Width: 1.6mm; Package Description: 2-Pin Surface Mount Device, Body 3.1 x 1.6 mm
R6 = CMP-02407-002229-1: RES Thick Film, 1.5kΩ, 1%, 0.25W, 100ppm/°C, 1206; Voltage Rating (DC): 200V; Power Rating: 250mW; Resistance: 1.5kR; Depth: 1.6mm; Case/Package: 1206; Packaging: Tape and Reel; Military Standard: Not; Radiation Hardening: No; Features: Automotive AEC-Q200; Number of Terminations: 2; Case Code (Imperial): 1206; Width: 0.063inch; Voltage Rating: 200V; Tolerance: 1%; Max Operating Temperature: 155°C; Weight: 0.000353oz; Package Quantity: 10; Temperature Coefficient: 100ppm/°C; Lead Free: Lead Free; Height: 0.024inch; Max Power Dissipation: 250mW; Termination: SMD/SMT; Length: 3.2mm; Contact Plating: Tin; Composition: Thick Film; Min Operating Temperature: -55°C; Case Code (Metric): 3216
R9 = CMP-2100-03674-1: Chip Resistor, 100 KOhm, +/- 1%, 0.25 W, -55 to 155 degC, 1206 (3216 Metric), RoHS, Tape and Reel; Manufacturer: Yageo; Voltage Rating: 200V; Temperature Coefficient: 100ppm/degreesC; Power Rating: 250mW; Case Code (Metric): 3216; Composition: ThickFilm; Lead Free: LeadFree; Max Operating Temperature: 155degC; Case/Package: 1206; Min Operating Temperature: -55degC; Depth: 1.6mm; RoHSCompliant: true; Datasheet URL: http://www.yageo.com/NewPortal/yageodocoutput?fileName=/pdf/R-Chip/PYu-RC_Group_51_RoHS_L_5.pdf; Datasheet Version: Rev. 5, 10/2016; Package Reference: 1206.0; Packaging: TapeandReel; Resistance: 100KOhm; Manufacturer URL: http://www.yageo.com/; Tolerance: 1%; Height: 0.55mm; REACH SVHC: NoSVHC; Case Code (Imperial): 1206; Length: 3.1mm; Package Description: 2-Pin Surface Mount Device, Body 3.1 x 1.6 mm; Termination: SMD/SMT
R10 R11 = CRM1206QFX-1003ELF: Resistor; Manufacturer_Name: Bourns; Datasheet Link: http://www.bourns.com/docs/Product-Datasheets/CRM-Q.pdf; Height: 0.65mm; Manufacturer_Part_Number: CRM1206QFX-1003ELF; Mouser Part Number: 652-CRM1206QFX-1003E; Mouser Price/Stock: https://www.mouser.co.uk/ProductDetail/Bourns/CRM1206QFX-1003ELF?qs=8Wlm6%252BaMh8RndkZYFfPU1w%3D%3D; Arrow Part Number: CRM1206QFX-1003ELF; Arrow Price/Stock: https://www.arrow.com/en/products/crm1206qfx-1003elf/bourns?region=nac
R12 = ERJ-8ENF2322V: Resistor; Manufacturer_Name: Panasonic; Datasheet Link: https://industrial.panasonic.com/cdbs/www-data/pdf/RDA0000/AOA0000C86.pdf; Height: 0.7mm; Manufacturer_Part_Number: ERJ-8ENF2322V; Mouser Part Number: 667-ERJ-8ENF2322V; Mouser Price/Stock: http://www.mouser.com/Search/ProductDetail.aspx?qs=JjxTDIFmKPScrlTsXwDTWg%3d%3d
R13 = ERJ-8ENF6492V: Resistor; Manufacturer_Name: Panasonic; Datasheet Link: https://industrial.panasonic.com/cdbs/www-data/pdf/RDA0000/AOA0000C86.pdf; Height: 0.7mm; Manufacturer_Part_Number: ERJ-8ENF6492V; Mouser Part Number: 667-ERJ-8ENF6492V
R14 = ERJ-8ENF1002V: Resistor; Manufacturer_Name: Panasonic; Datasheet Link: https://industrial.panasonic.com/cdbs/www-data/pdf/RDA0000/AOA0000C86.pdf; Height: 0.7mm; Manufacturer_Part_Number: ERJ-8ENF1002V; Mouser Part Number: 667-ERJ-8ENF1002V; Mouser Price/Stock: https://www.mouser.co.uk/ProductDetail/Panasonic/ERJ-8ENF1002V?qs=tQNqqtTOejJ8WW2Q5R5omg%3D%3D; Arrow Part Number: ERJ-8ENF1002V; Arrow Price/Stock: https://www.arrow.com/en/products/erj-8enf1002v/panasonic?region=nac
R15 = CMP-2003-01938-1: Manufacturer: Vishay Dale; Part Number: CRCW1206205KFKEA
R16 = CMP-2001-00032-1: Manufacturer: Panasonic; Part Number: ERJ-6ENF2052V
R17 = CMP-1659-00013-4: Chip Resistor, 10 KOhm, +/- 1%, 0.125 W, -55 to 155 degC, 0805 (2012 Metric), RoHS, Tape and Reel; Manufacturer: Yageo; Voltage Rating: 150 V; Mount: Surface Mount; ComponentLink1Description: Manufacturer URL; ComponentLink2URL: http://www.yageo.com/documents/recent/PYu-RC_Group_51_RoHS_L_04.pdf; Pins: 2; Length: 2 mm; Min Operating Temperature: -55 degC; Height: 0.5 mm; Mounting Technology: Surface Mount; RoHSCompliant: true; REACH SVHC: No SVHC; ComponentLink1URL: http://www.yageo.com/; Max Operating Temperature: 155 degC; PackageReference: 0805; DatasheetVersion: Rev. 4, 02/2016; Package Quantity: 5000; Packaging: Tape and Reel; ComponentLink2Description: Datasheet; PackageDescription: 2-Pin Surface Mounted Device, Body 2 x 1.25 mm
R18 = CMP-2003-00123-1: Part Number: ERJ-8ENF1542V; Manufacturer: Panasonic
R20 = CMP-2003-04387-1: Manufacturer: Panasonic; Part Number: ERA-8AEB1333V
S1 S2 = FSMSM: Switch; Manufacturer_Name: TE Connectivity; Datasheet Link: http://uk.rs-online.com/web/p/products/7182477; Manufacturer_Part_Number: FSMSM; Mouser Part Number: 506-FSMSM; Mouser Price/Stock: https://www.mouser.co.uk/ProductDetail/TE-Connectivity-Alcoswitch/FSMSM?qs=UhRTNahLC3yPLf3YjzjKAA%3D%3D; Arrow Part Number: FSMSM; Arrow Price/Stock: https://www.arrow.com/en/products/fsmsm/te-connectivity?region=nac
U1 = CMP-0479-00425-2: IC OR CTRLR SRC SELECT TSOT23-6; Min Supply Voltage: 2.5V; Max Supply Voltage: 28V; Turn-On Delay Time: 110us; Number of Channels: 1; Lead Free: Lead Free; Length: 2.9mm; Radiation Hardening: No; RoHS Compliant: Yes; Package Quantity: 1; Min Operating Temperature: -40°C; Series: PowerPath™; Packaging: Tape and Reel; Width: 1.75mm; Height: 0.9mm; Number of Pins: 6; Max Operating Temperature: 85°C; Number of Outputs: 1; Case/Package: TSOT; REACH SVHC: No SVHC